# Altium schematic sheet AudioAY.SchDoc
size A4
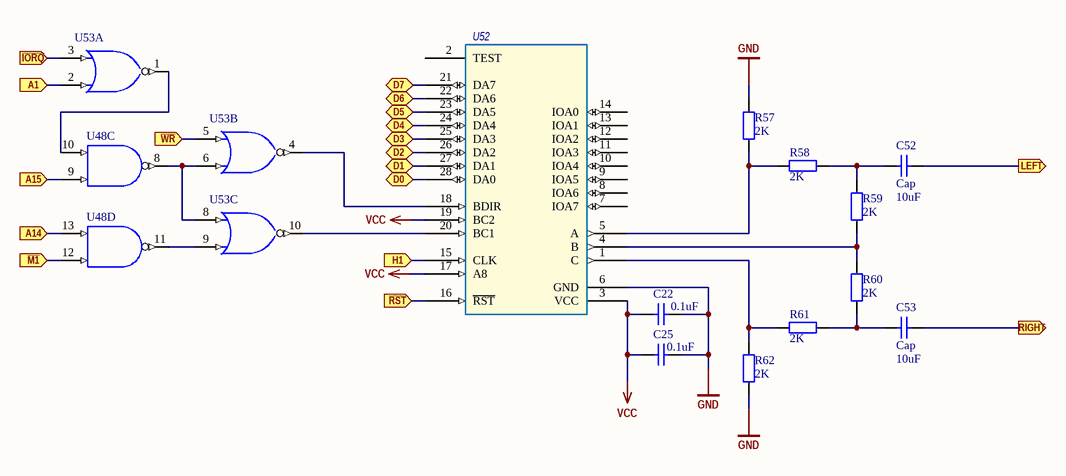
[diagram p0: AudioAY.SchDoc]

## Parts
C22  value 0.1uF  [RAD-0.3]  (hidden comment: Cap)
C25  value 0.1uF  [RAD-0.3]  (hidden comment: Cap)
C52  Cap  value 10uF  [RAD-0.3]
C53  Cap  value 10uF  [RAD-0.3]
R57  value 2K  [AXIAL-0.4]  (hidden comment: Res2)
R58  value 2K  [AXIAL-0.4]  (hidden comment: Res2)
R59  value 2K  [AXIAL-0.4]  (hidden comment: Res2)
R60  value 2K  [AXIAL-0.4]  (hidden comment: Res2)
R61  value 2K  [AXIAL-0.4]  (hidden comment: Res2)
R62  value 2K  [AXIAL-0.4]  (hidden comment: Res2)
U48  SN74HC00N  [N014]  (value not drawn)  (parts C,D of 4)
U52  AY-3-8912  [FDIP28W]  (value not drawn)
U53  SN74HC02N  [N014]  (value not drawn)  (parts A,B,C of 4)

## Ports
A1 (in), A14 (in), A15 (in), D0 (bidir), D1 (bidir), D2 (bidir), D3 (bidir), D4 (bidir), D5 (bidir), D6 (bidir), D7 (bidir), H1 (in), LEFT (out), RIGHT (out), ~{IORQ} (in), ~{M1} (in), ~{RST} (in), ~{WR} (in)

## Nets
GND: C22.2 C25.2 R57.2 R62.1 U48.7(GND) U52.6(GND) U53.7(GND)
VCC: C22.1 C25.1 U48.14(VCC) U52.3(VCC) U52.17(A8) U52.19(BC2) U53.14(VCC)
A1: U53.2(A) ; port A1
A14: U48.13(B) ; port A14
A15: U48.9(A) ; port A15
D0: U52.28(DA0) ; port D0
D1: U52.27(DA1) ; port D1
D2: U52.26(DA2) ; port D2
D3: U52.25(DA3) ; port D3
D4: U52.24(DA4) ; port D4
D5: U52.23(DA5) ; port D5
D6: U52.22(DA6) ; port D6
D7: U52.21(DA7) ; port D7
H1: U52.15(CLK) ; port H1
~{IORQ}: U53.3(B) ; port ~{IORQ}
LEFT: C52.2 ; port LEFT
~{M1}: U48.12(A) ; port ~{M1}
~{RST}: U52.16(~{RST}) ; port ~{RST}
RIGHT: C53.2 ; port RIGHT
~{WR}: U53.5(A) ; port ~{WR}
NetC52_1: C52.1 R58.2 R59.2
NetC53_1: C53.1 R60.1 R61.2
NetR57_1: R57.1 R58.1 U52.5(A)
NetR59_1: R59.1 R60.2 U52.4(B)
NetR61_1: R61.1 R62.2 U52.1(C)
NetU48_8: U48.8(Y) U53.6(B) U53.8(A)
NetU48_10: U48.10(B) U53.1(Y)
NetU48_11: U48.11(Y) U53.9(B)
NetU52_18: U52.18(BDIR) U53.4(Y)
NetU52_20: U52.20(BC1) U53.10(Y)

Not connected (* = marked no-connect by the designer): U52 2(TEST) 7(IOA7) 8(IOA6) 9(IOA5) 10(IOA4) 11(IOA3) 12(IOA2) 13(IOA1) 14(IOA0)

## Library data of the parts
C22 C25 C52 C53 = Cap: Capacitor; Published: 8-Jun-2000; LatestRevisionDate: 17-Jul-2002; LatestRevisionNote: Re-released for DXP Platform.; PackageReference: RAD-0.3; Publisher: Altium Limited; PackageDescription: Radial Cap, Thru-Hole; 2 Leads; 0.3 in Pin Spacing
R57-R62 = Res2: Resistor; Published: 8-Jun-2000; LatestRevisionDate: 17-Jul-2002; LatestRevisionNote: Re-released for DXP Platform.; PackageReference: AXIAL-0.4; Publisher: Altium Limited; PackageDescription: Axial Device, Thru-Hole; 2 Leads; 0.4 in Pin Spacing
U48 = SN74HC00N: Quadruple 2-Input Positive-NAND Gate; Published: 8-Jun-2000; LatestRevisionDate: 04-Mar-2005; LatestRevisionNote: Stylized 3D Model Added.; DatasheetVersion: May-1997; PackageVersion: Oct-1995; PackageReference: N014; Publisher: Altium Limited; PackageDescription: DIP; 14 Leads; Row Spacing 7.62 mm; Pitch 2.54 mm; ComponentLink1Description: Manufacturer Link; ComponentLink1URL: http://www.ti.com/; ComponentLink2Description: Datasheet; ComponentLink2URL: http://www-s.ti.com/sc/ds/sn74hc00.pdf
U53 = SN74HC02N: Quadruple 2-Input Positive-NOR Gate; Published: 8-Jun-2000; LatestRevisionDate: 04-Mar-2005; LatestRevisionNote: Stylized 3D Model Added.; DatasheetVersion: May-1997; PackageVersion: Oct-1995; PackageReference: N014; Publisher: Altium Limited; PackageDescription: DIP; 14 Leads; Row Spacing 7.62 mm; Pitch 2.54 mm; ComponentLink1Description: Manufacturer Link; ComponentLink1URL: http://www.ti.com/; ComponentLink2Description: Datasheet; ComponentLink2URL: http://www-s.ti.com/sc/ds/sn74hc02.pdf